# Altium project MC_CK.PrjPcb
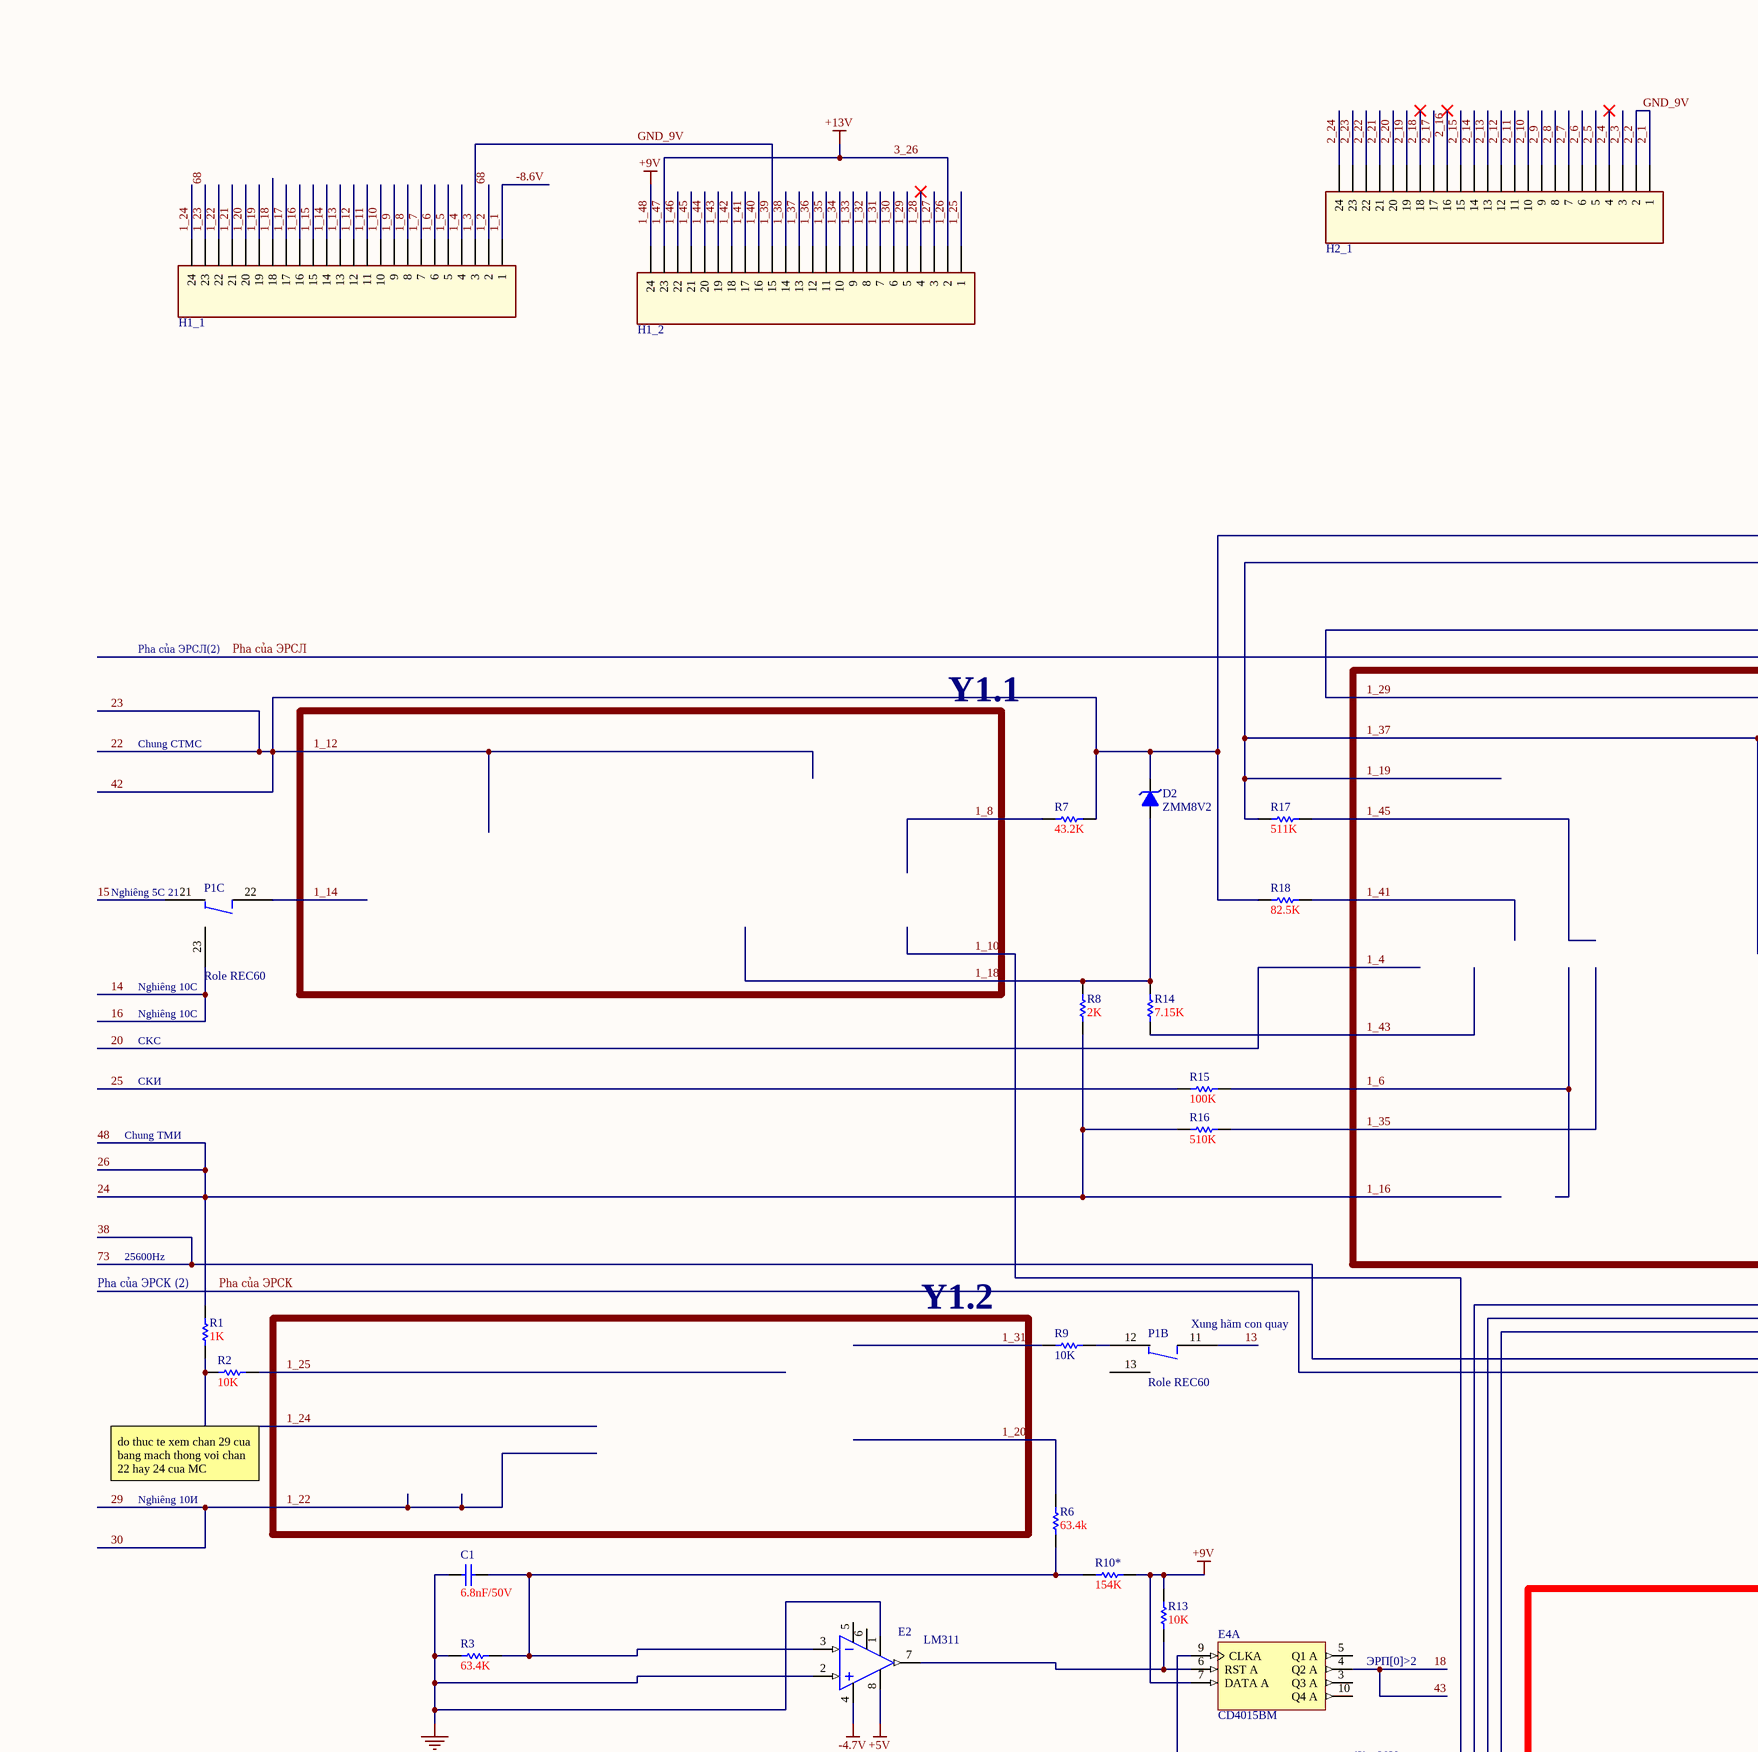
[diagram p0: MC1516.SchDoc, top left]
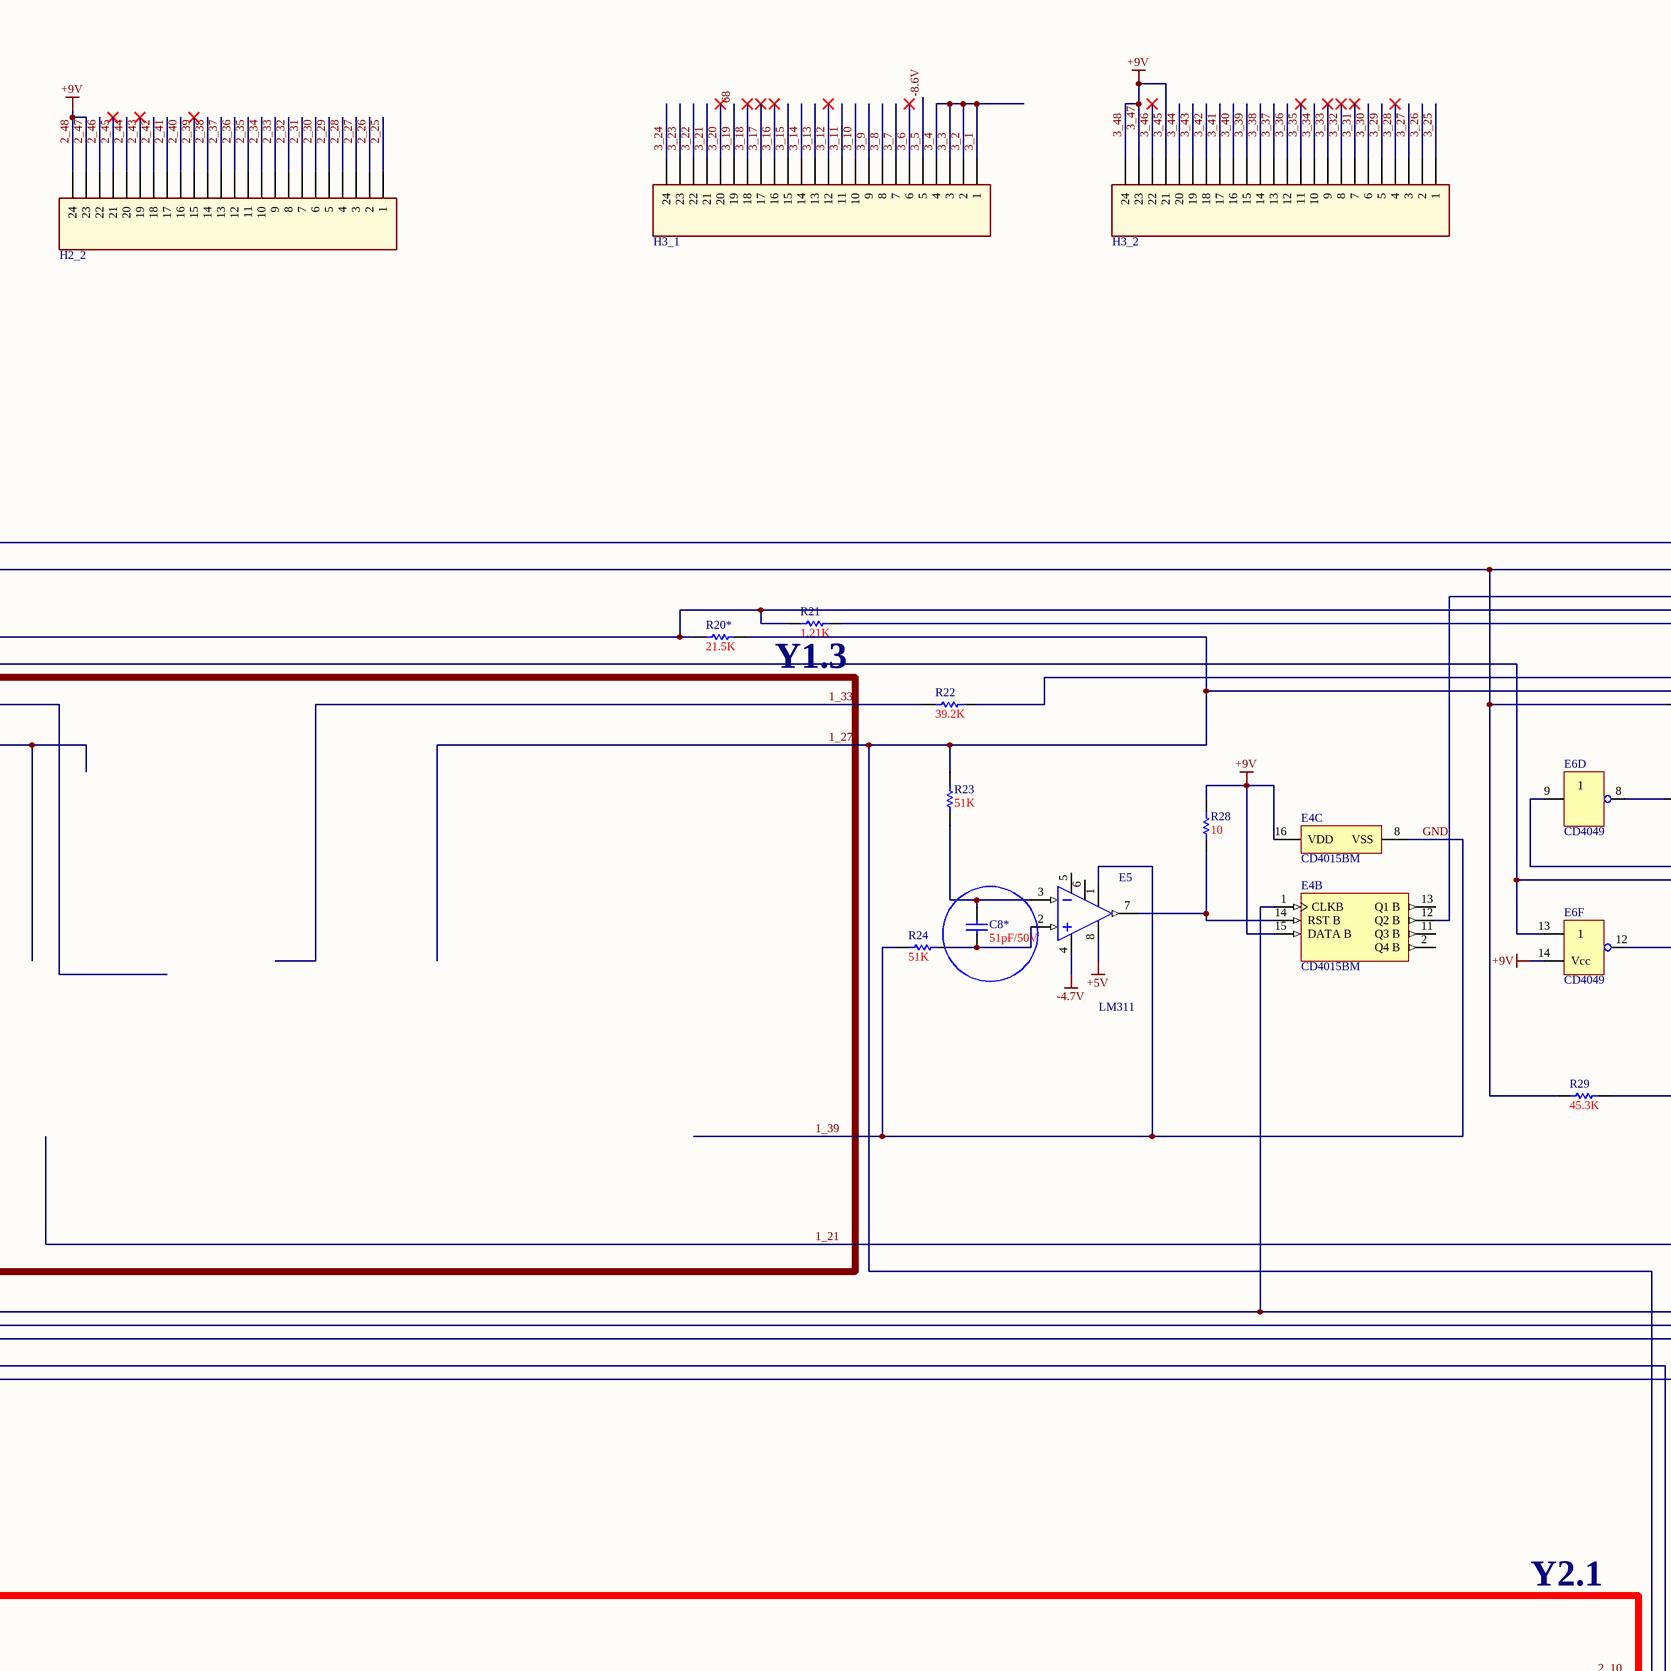
[diagram p1: MC1516.SchDoc, top middle]
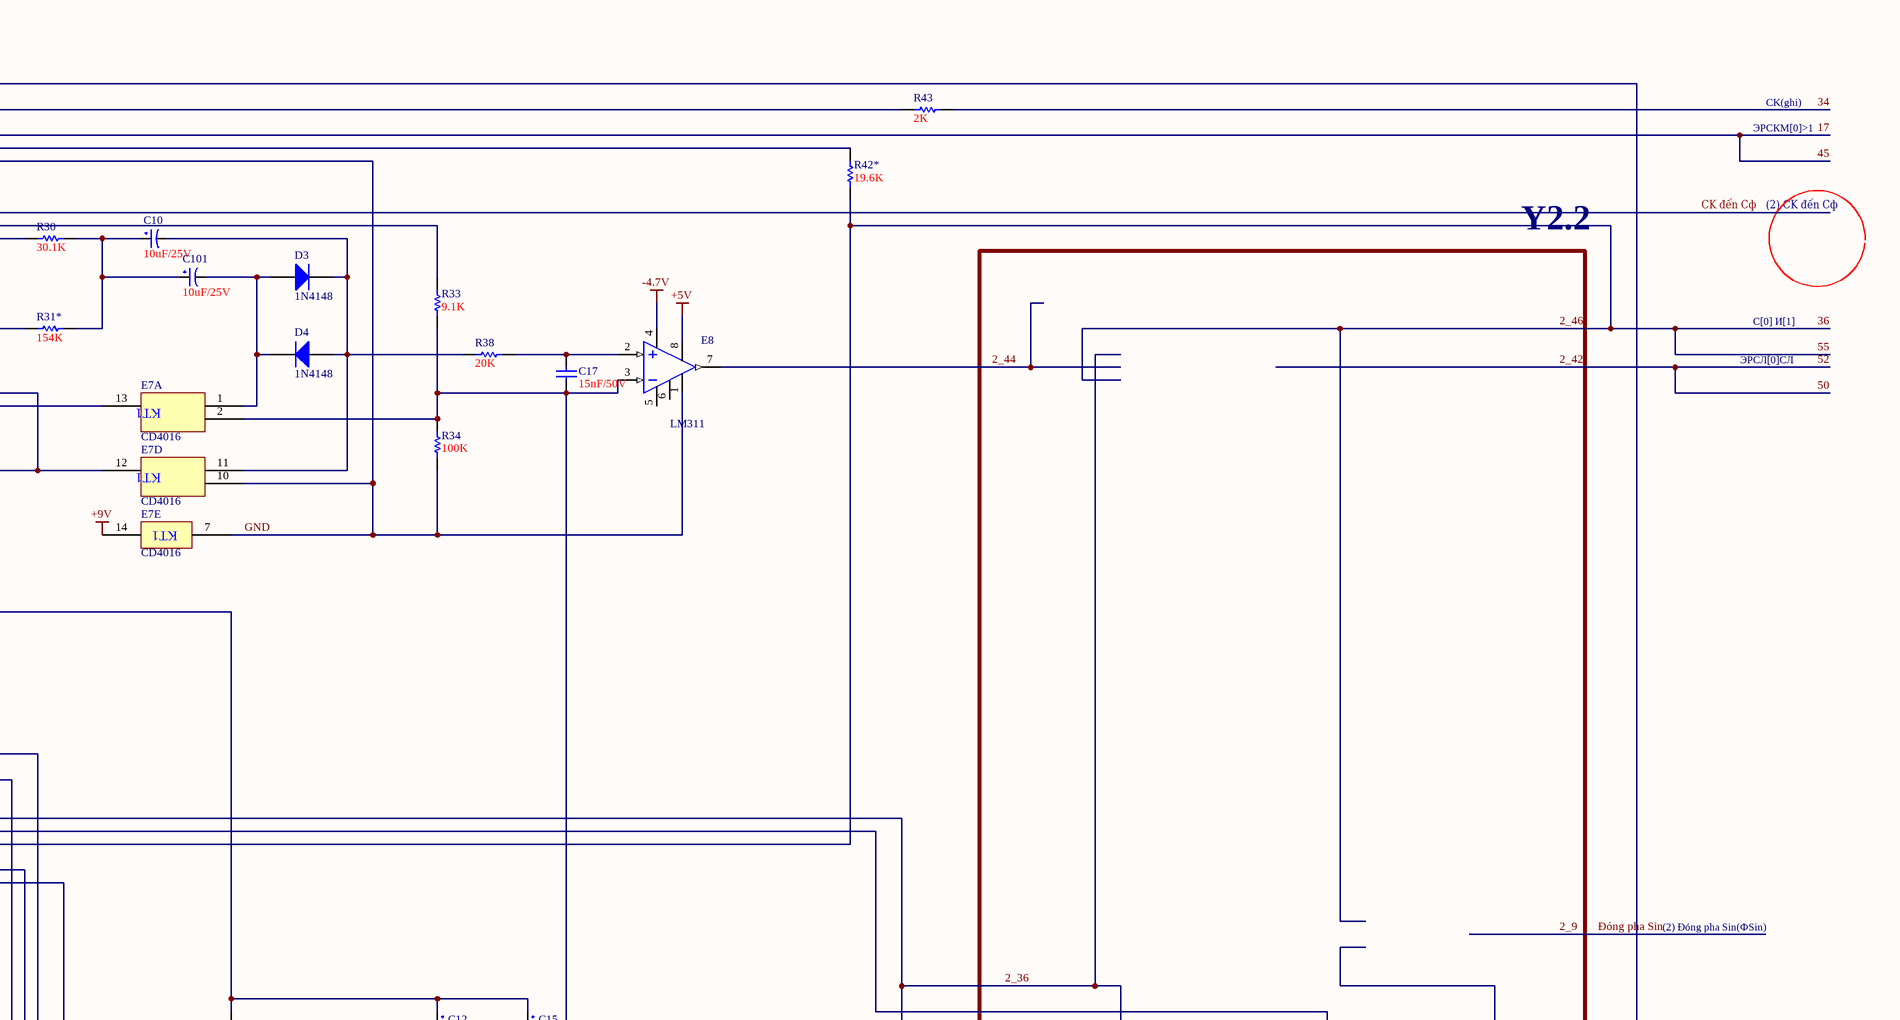
[diagram p2: MC1516.SchDoc, top right]
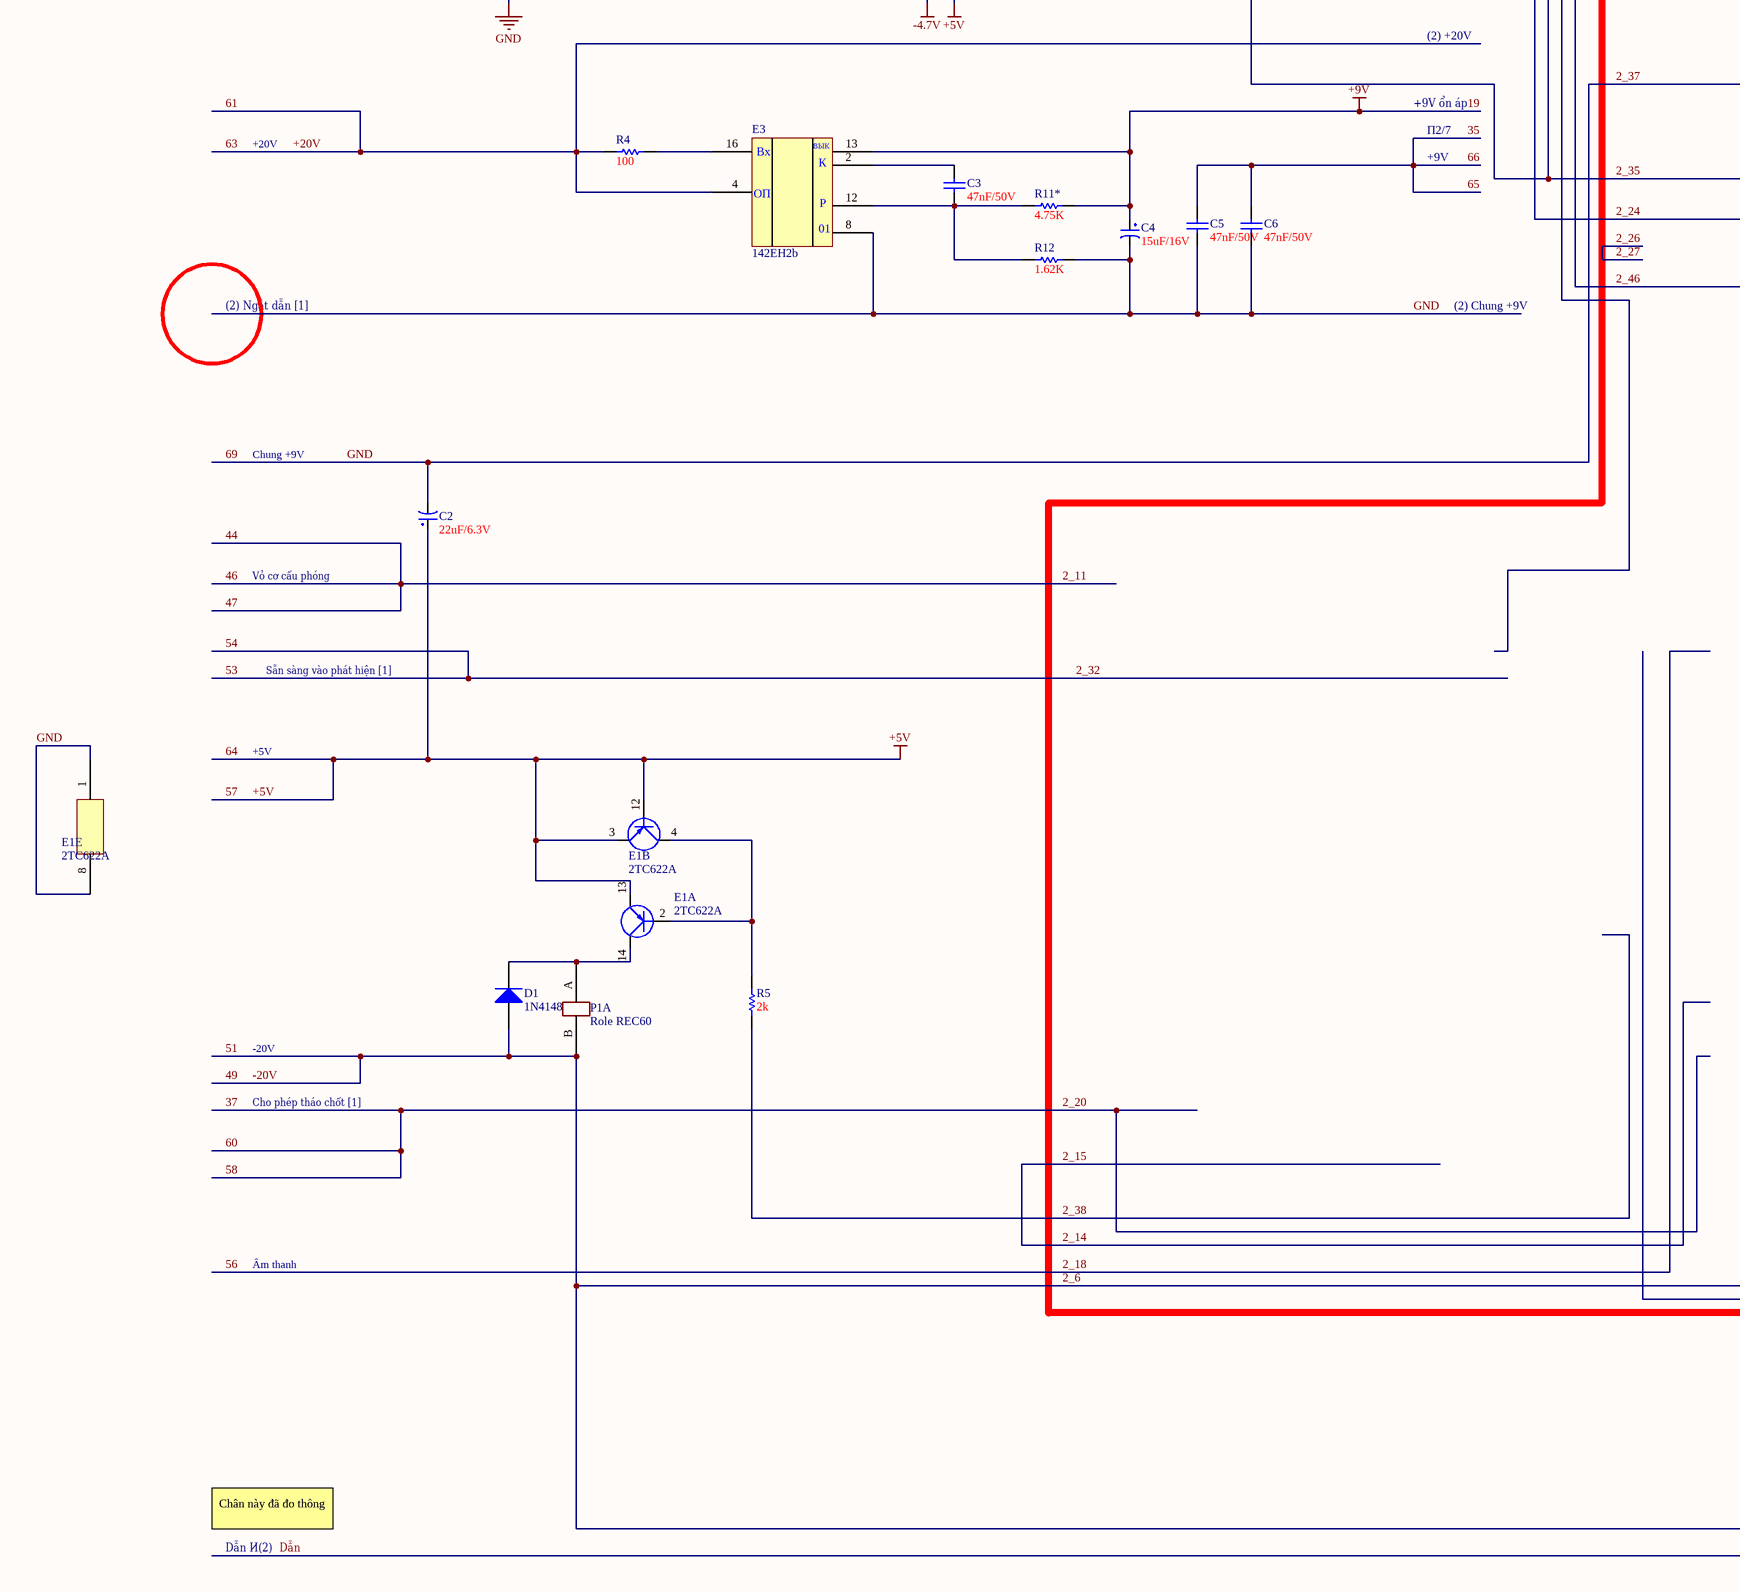
[diagram p3: MC1516.SchDoc, bottom left]
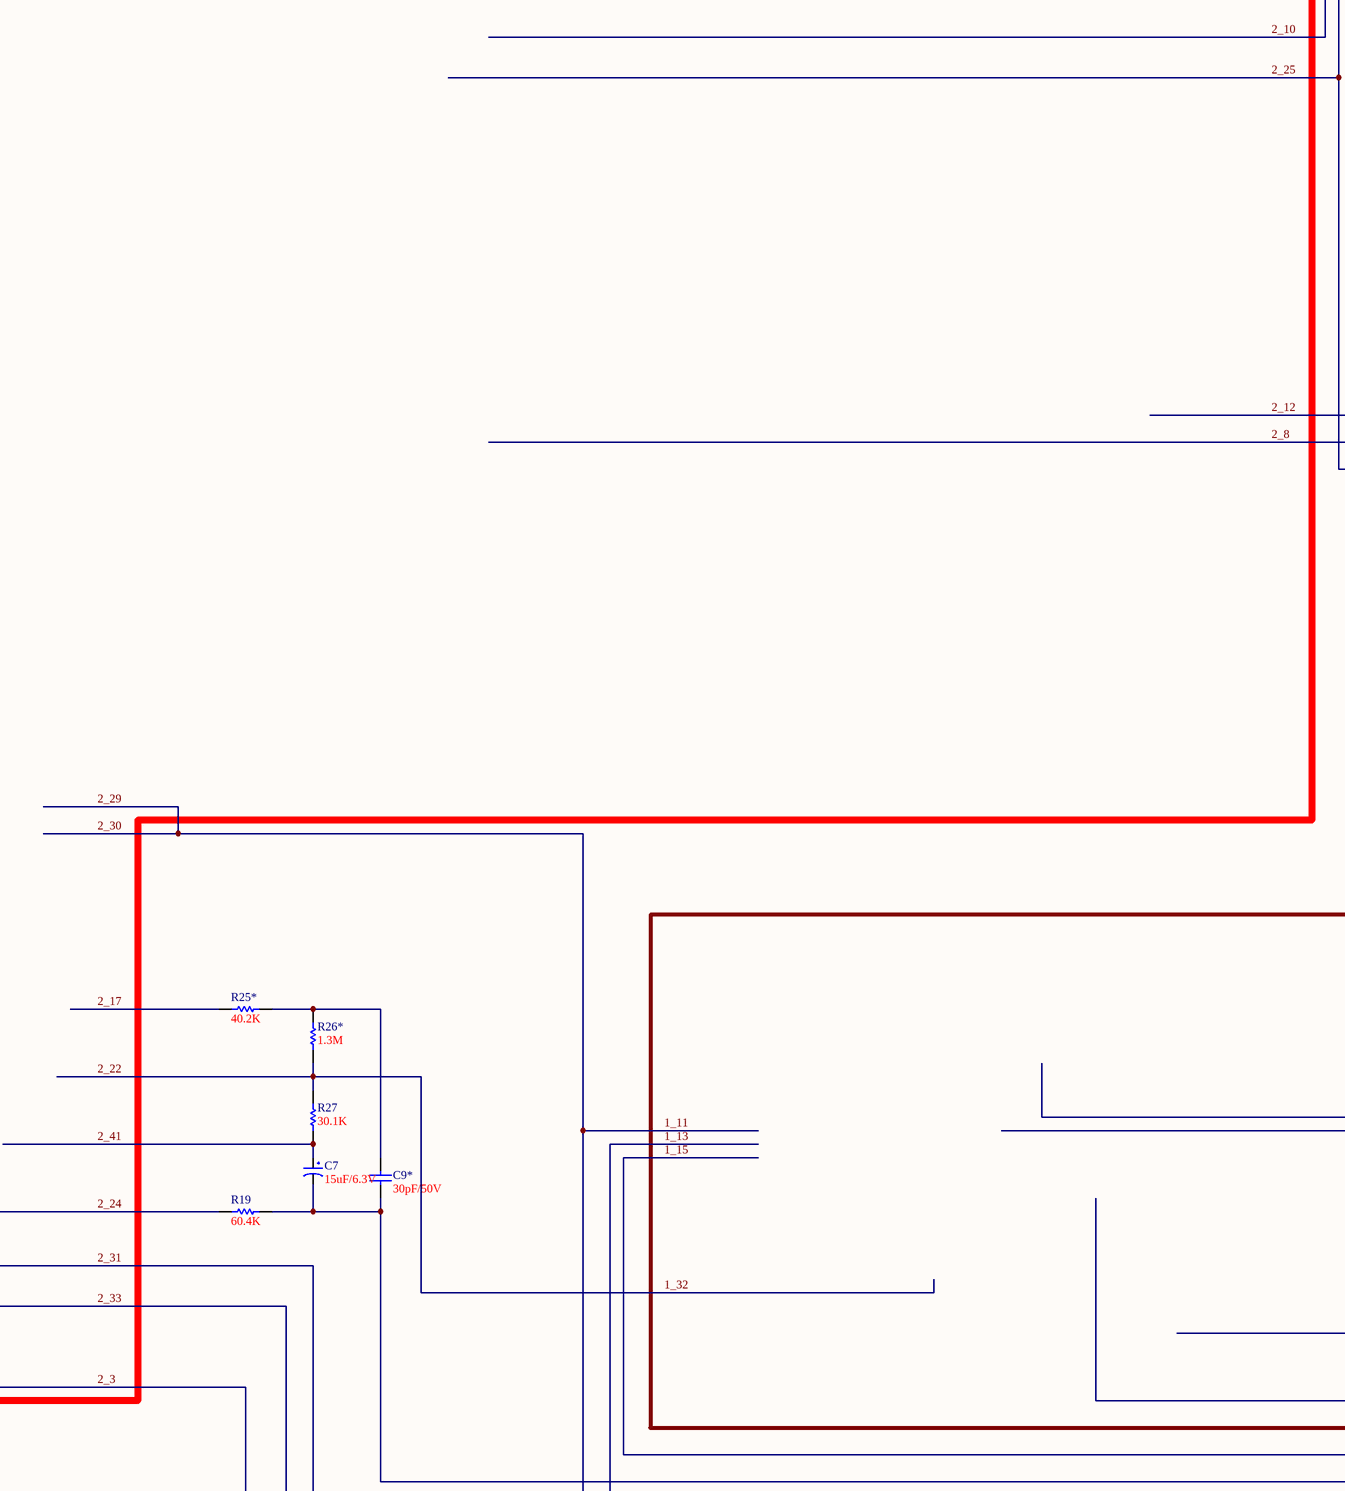
[diagram p4: MC1516.SchDoc, bottom middle]
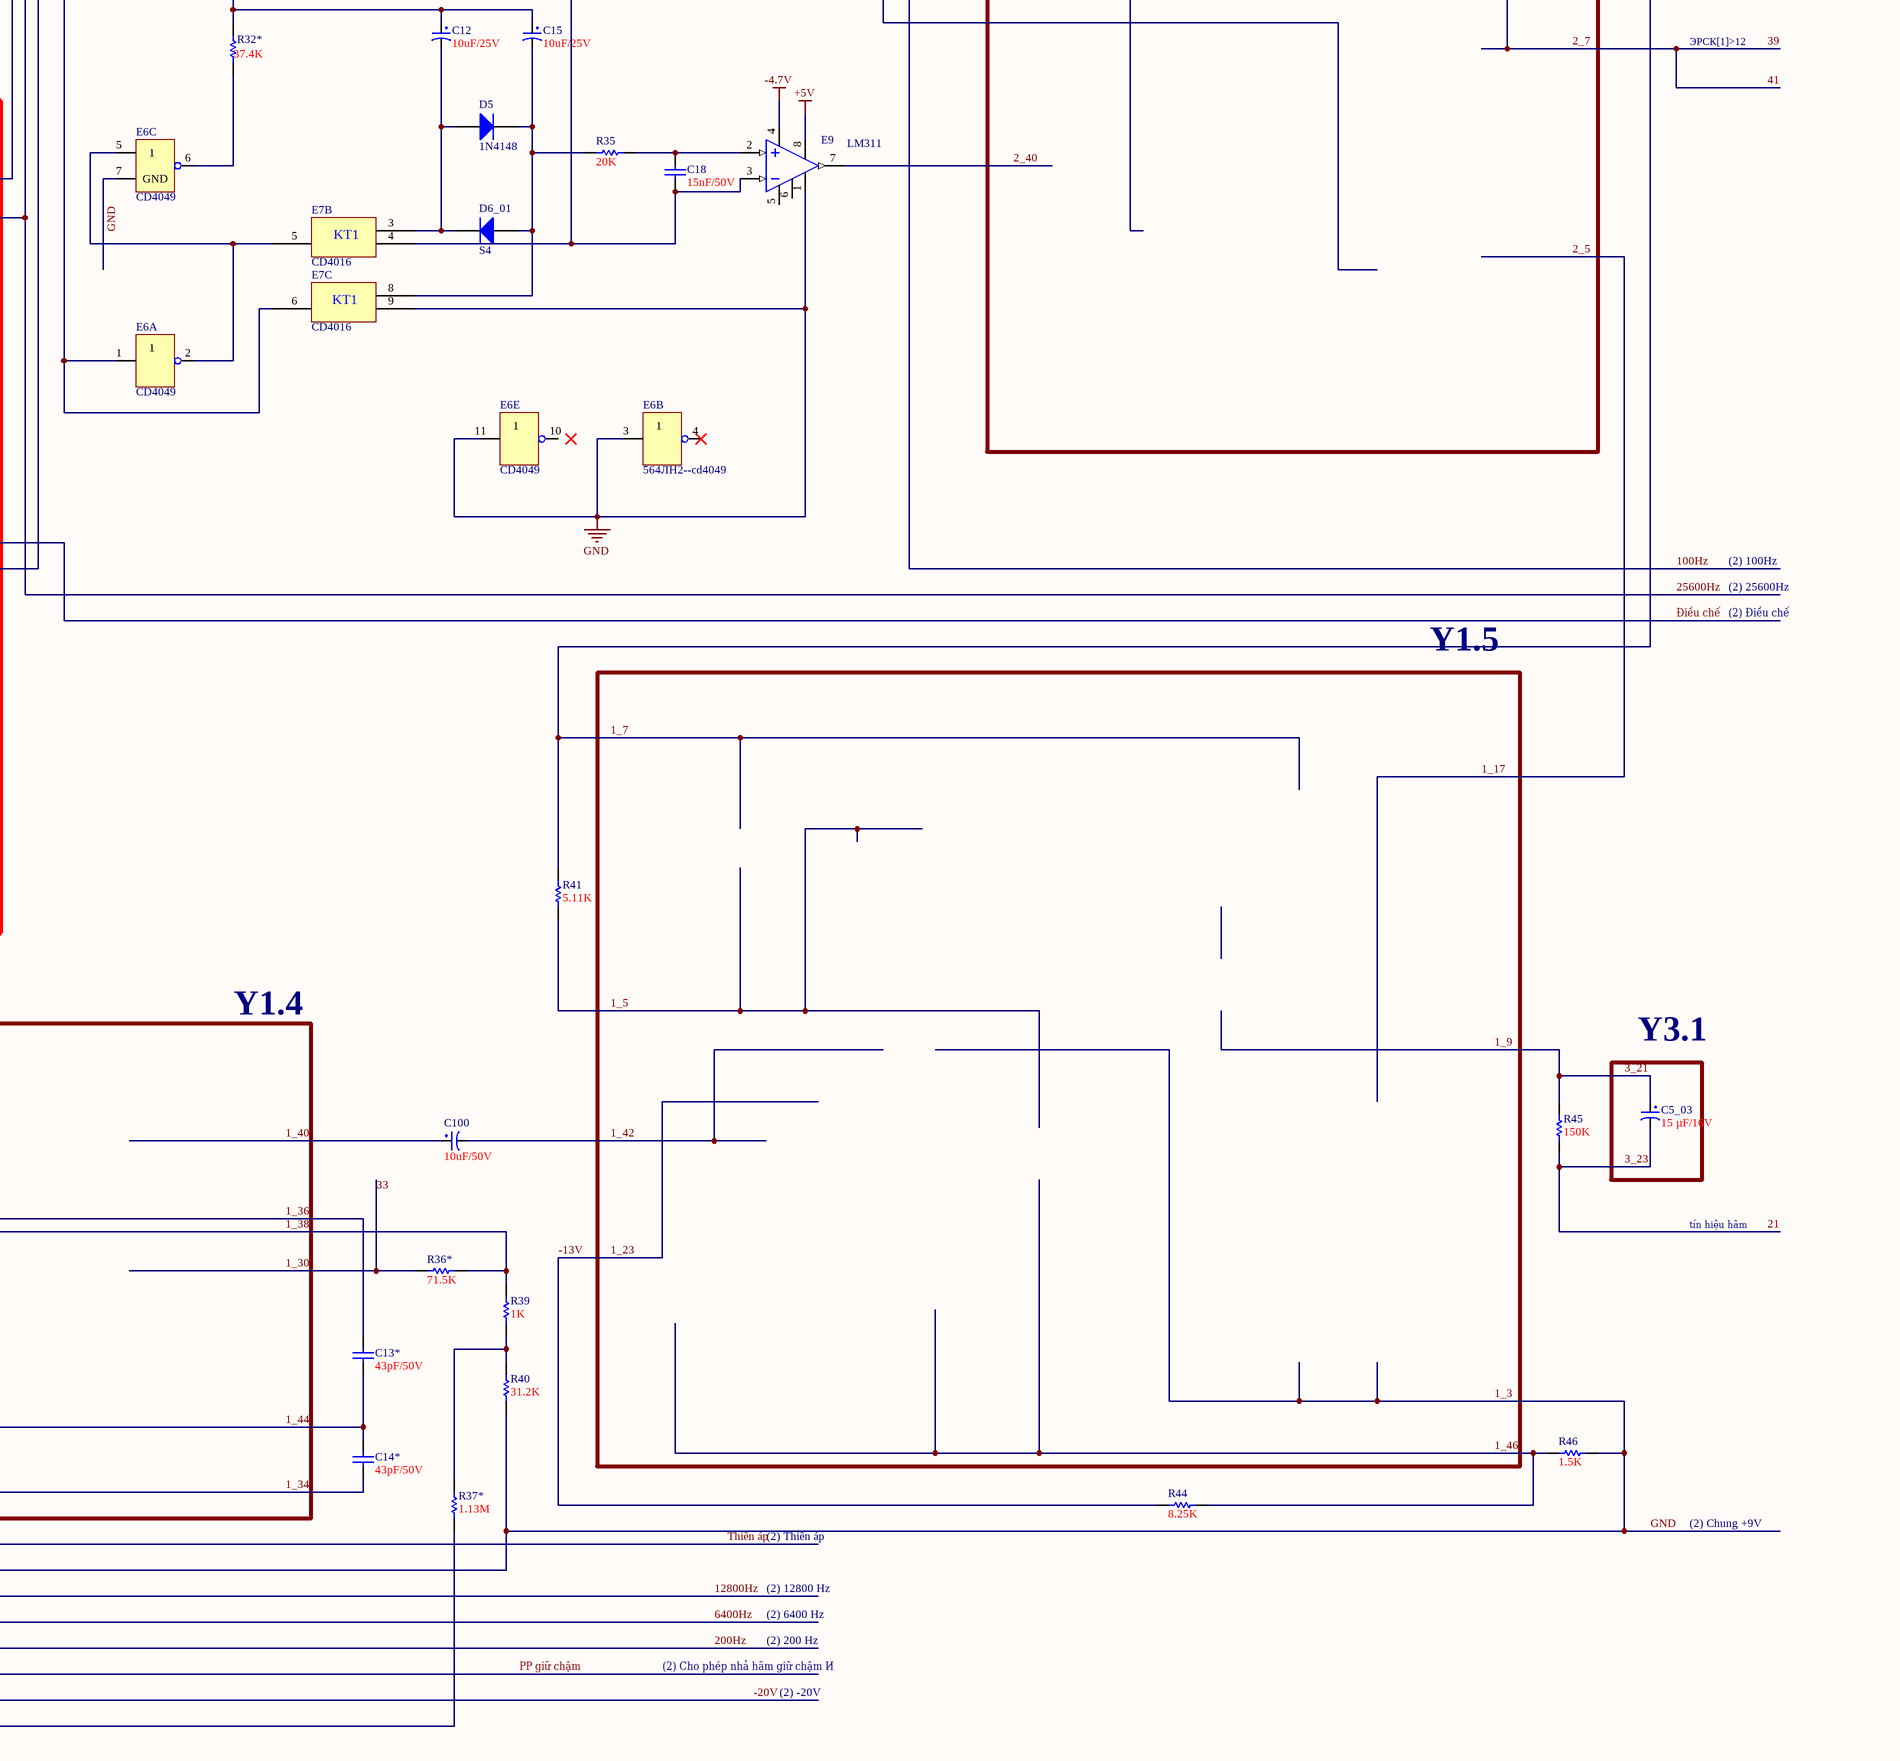
[diagram p5: MC1516.SchDoc, bottom right]
2 sheets, 124 parts. Net scope: global (net labels, ports and power ports of the same name join across sheets).
Board file: MC_CK.PcbDoc
Sheets:
  MC1516.SchDoc
  MC1617.SchDoc

## Sheet MC1516.SchDoc
size A0; SheetNumber: 1; SheetTotal: 2

### Parts
C1  6.8nF/50V  [C0805]
C2  22uF/6.3V  [3216]
C3  47nF/50V  [C0805]
C4  15uF/16V  [C3528]
C5  47nF/50V  [C0805]
C5_03  15 µF/16V  [3528]
C6  47nF/50V  [C0805]
C7  15uF/6.3V  [3216]
C8*  51pF/50V  [C0805]
C9*  30pF/50V  [C0805]
C10  10uF/25V  [3528]
C12  10uF/25V  [3528]
C13*  43pF/50V  [C0805]
C14*  43pF/50V  [C0805]
C15  10uF/25V  [3528]
C17  15nF/50V  [C0805]
C18  15nF/50V  [C0805]
C100  10uF/50V  [3528]
C101  10uF/25V  [3528]
D1  1N4148  [sod123]
D2  ZMM8V2  [sod-80]
D3  1N4148  [sod123]
D4  1N4148  [sod123]
D5  1N4148  [sod123]
D6_01  S4  [SOD123]
E1  2ТС622А  [1533LN1]  (parts A,B,E of 5)
E2  LM311  [soic8]
E3  142EH2b  [142EN2A]
E4  CD4015BM  [soic16n]  (parts A,B,C of 3)
E5  LM311  [soic8]
E6  CD4049  [soic14]  (parts A,B,C,D,E,F of 6)
E7  CD4016  [soic14]  (parts A,B,C,D,E of 5)
E8  LM311  [soic8]
E9  LM311  [soic8]
H1_1  Header 24  [header 24]  (value not drawn)
H1_2  Header 24  [header 24]  (value not drawn)
H2_1  Header 24  [header 24]  (value not drawn)
H2_2  Header 24  [header 24]  (value not drawn)
H3_1  Header 24  [header 24]  (value not drawn)
H3_2  Header 24  [header 24]  (value not drawn)
P1  Role REC60  [REK60]  (parts A,B,C of 3)
R1  1K  [R0805]
R2  10K  [R0805]
R3  63.4K  [R0805]
R4  100  [res1206]
R5  2k  [R0805]
R6  63.4k  [R0805]
R7  43.2K  [R0805]
R8  2K  [R0805]
R9  10K  [R0805]
R10*  154K  [R0805]
R11*  4.75K  [R0805]
R12  1.62K  [R0805]
R13  10K  [R0805]
R14  7.15K  [R0805]
R15  100K  [r0805]
R16  510K  [R0805]
R17  511K  [R0805]
R18  82.5K  [R0805]
R19  60.4K  [R0805]
R20*  21.5K  [R0805]
R21  1.21K  [R0805]
R22  39.2K  [R0805]
R23  51K  [R0805]
R24  51K  [R0805]
R25*  40.2K  [R0805]
R26*  1.3M  [R0805]
R27  30.1K  [R0805]
R28  10  [R0805]
R29  45.3K  [R0805]
R30  30.1K  [R0805]
R31*  154K  [R0805]
R32*  37.4K  [R0805]
R33  9.1K  [R0805]
R34  100K  [R0805]
R35  20K  [R0805]
R36*  71.5K  [R0805]
R37*  1.13M  [R0805]
R38  20K  [R0805]
R39  1K  [R0805]
R40  31.2K  [R0805]
R41  5.11K  [R0805]
R42*  19.6K  [R0805]
R43  2K  [R0805]
R44  8.25K  [R0805]
R45  150K  [R0805]
R46  1.5K  [R0805]

### Blocks framed on the sheet
Y3.1: C5_03

### Nets
1_3: C1.2 C2.2 C4.2 C5.2 C6.2 C7.2 C9*.2 E1.1 E1.8 E2.1(COM) E2.2(IN+) E3.8 E4.8(VSS) E5.1(COM) E6.3 E6.7(GND) E6.11 E7.7 E7.9 E7.10 E8.1(COM) E9.1(COM) H1_1.3 H1_2.15 H2_1.1 H2_1.2 H2_2.13 H3_1.1 H3_1.2 H3_1.3 H3_1.4 R3.2 R12.1 R19.2 R21.2 R24.2 R34.2 R40.2 R46.2  [also labelled 1_39, 2_1, 2_2, 2_37, 3_1, 3_2, 3_3, 3_4, 69, GND, GND_9V]
1_26: H1_2.2 H1_2.23 H3_2.2  [also labelled +13V, 1_47, 3_26]
19: C4.1 C5.1 C6.1 E3.13 E4.7(DATA_A) E4.15(DATA_B) E4.16(VDD) E6.14(Vcc) E7.14 H1_1.4 H1_2.24 H2_2.23 H2_2.24 H3_2.21 H3_2.23 H3_2.24 R10*.1 R11*.1 R13.1 R28.2  [also labelled +9V, 1_4, 1_48, 20, 2_47, 2_48, 35, 3_45, 3_47, 3_48, 65, 66]
+5V: C2.1 E1.3 E1.12 E1.13 E2.8(+V) E5.8(+V) E8.8(+V) E9.8(+V)  [also labelled 57, 64]
-4.7V: E2.4(-V) E5.4(-V) E8.4(-V) E9.4(-V) H1_1.15 H2_1.19 H3_2.20  [also labelled 1_15, 2_19, 3_44, Thiên áp]
1_5: H1_1.5 R41.2
1_6: H1_1.6 R15.1
1_8: H1_1.8 R7.1
1_9: C5_03.1 H1_1.9 H3_1.21 R45.2  [also labelled 3_21]
1_10: H1_1.10 H2_1.24 R19.1  [also labelled 2_24]
1_12: D2.2(K) H1_1.7 H1_1.12 R7.2 R18.2 R41.1  [also labelled 1_7, 22, 23, 42]
1_13: H1_1.13 H2_2.7 H3_2.16  [also labelled 2_31, 3_40, 6400Hz]
1_14: H1_1.14 P1.22
1_16: H1_1.16 R1.1 R8.1 R16.2  [also labelled 24, 26, 48]
1_17: H1_1.17 H2_1.5  [also labelled 2_5]
1_18: D2.1(A) H1_1.18 R8.2 R14.2
1_19: H1_1.19 H1_2.13 R17.2 R29.1 R30.2 R43.1  [also labelled 1_37]
1_20: H1_1.20 R6.2
1_21: H1_1.21 H2_1.8  [also labelled 2_8]
1_22: H1_1.22  [also labelled 29, 30]
1_24: H1_1.24 R1.2 R2.1
1_25: H1_2.1 R2.2
1_27: H1_2.3 H2_1.10 R20*.2 R23.2 R33.1  [also labelled 2_10]
1_28: H1_2.4
1_29: H1_2.5 R20*.1 R21.1 R42*.1
1_30: H1_2.6 R36*.2  [also labelled 33]
1_31: H1_2.7 R9.2
1_32: H1_2.8 H2_1.22 R26*.1 R27.2  [also labelled 2_22]
1_33: H1_2.9 R22.1
1_34: C14*.2 H1_2.10
1_35: H1_2.11 R16.1
1_36: C13*.1 H1_2.12
1_38: H1_2.14 R36*.1 R39.1
1_40: C100.1 H1_2.16
1_41: H1_2.17 R18.1
1_42: C100.2 H1_2.18
1_43: H1_2.19 R14.1
1_44: C13*.2 C14*.1 H1_2.20
1_45: H1_2.21 R17.1
1_46: H1_2.22 R44.2 R46.1
2_3: H2_1.3 H3_1.14  [also labelled 3_14, PP giữ chậm]
2_4: H2_1.4
2_7: H2_1.7  [also labelled 39, 41]
2_9: H2_1.9 H3_2.19  [also labelled 3_43, Đóng pha Sin]
2_11: H2_1.11  [also labelled 44, 46, 47]
2_12: H2_1.12 H2_1.13  [also labelled 2_13, Điều chế]
2_14: H2_1.14 H2_1.15  [also labelled 2_15]
2_16: H2_1.16
2_17: H2_1.17 R25*.1
2_18: H2_1.18  [also labelled 56]
2_20: H2_1.20  [also labelled 37, 58, 60]
2_21: H2_1.21
2_23: H2_1.23 R22.2  [also labelled CK đến Cф]
2_26: H2_2.2 H2_2.3  [also labelled 2_27]
2_32: H2_2.8  [also labelled 53, 54]
2_38: H2_2.14 R5.2
2_39: H2_2.15
2_40: E9.7(OUT) H2_2.16
2_41: C7.1 H2_2.17 R27.1
2_42: H2_2.18  [also labelled 50, 52]
2_43: H2_2.19
2_44: E8.7(OUT) H2_2.20
2_45: H2_2.21
2_46: H2_2.22 R42*.2  [also labelled 36, 55]
3_6: H3_1.6
3_7: H3_1.7
3_8: H3_1.8
3_9: H3_1.9
3_11: H3_1.11
3_12: H3_1.12
3_13: H3_1.13
3_15: H3_1.15
3_16: H3_1.16
3_17: H3_1.17
3_18: H3_1.18
3_20: H3_1.20
3_22: H3_1.22
3_24: H3_1.24
3_25: H3_2.1
3_27: E6.1 E7.6 H3_2.3  [also labelled Pha của ЭРСК]
3_28: H3_2.4
3_30: H3_2.6
3_31: H3_2.7
3_32: H3_2.8
3_33: H3_2.9
3_34: H3_2.10
3_35: H3_2.11
3_36: H3_2.12
3_37: H3_2.13
3_39: E6.13 E7.13 H3_2.15  [also labelled Pha của ЭРСЛ]
3_41: H3_2.17
3_42: H3_2.18 R37*.2  [also labelled Dẫn]
3_46: H3_2.22
13: P1.11
14: P1.23  [also labelled 16]
15: P1.21
17: E4.12(Q2_B)  [also labelled 45]
18: E4.4(Q2_A)  [also labelled 43]
21: C5_03.2 H3_1.23 R45.1  [also labelled 3_23]
25: R15.2
34: R43.2
100Hz: E4.1(CLKB) E4.9(CLKA) H2_2.11 H2_2.12 H3_2.5  [also labelled 2_35, 2_36, 3_29]
200Hz: H2_2.9 H2_2.10  [also labelled 2_33, 2_34]
12800Hz: H1_1.11 H2_2.5 H2_2.6 H3_2.14  [also labelled 1_11, 2_29, 2_30, 3_38]
25600Hz: H2_2.1 H3_1.10  [also labelled 2_25, 38, 3_10, 73]
+20V: E3.4 H2_2.4 R4.2  [also labelled 2_28, 61, 63]
-8.6V: H1_1.1 H3_1.5  [also labelled 1_1, 3_5]
-13V: H1_1.2 H1_1.23 H3_1.19 R44.1  [also labelled 1_2, 1_23, 3_19, 68]
-20V: D1.1(A) H2_1.6 P1.B  [also labelled 2_6, 49, 51]
NetC1_1: C1.1 E2.3(IN-) R3.1 R6.1 R10*.2
NetC3_1: C3.1 E3.2
NetC3_2: C3.2 E3.12 R11*.2 R12.2
NetC8*_1: C8*.1 E5.3(IN-) R23.1
NetC8*_2: C8*.2 E5.2(IN+) R24.1
NetC9*_1: C9*.1 R25*.2 R26*.2
NetC10_1: C10.1 C101.1 R30.1 R31*.1
NetC10_2: C10.2 D3.2(K) D4.1(A) E7.11 R38.1
NetC12_1: C12.1 C15.1 R29.2 R32*.1
NetC12_2: C12.2 D5.1(A) D6_01.2(K) E7.3
NetC15_2: C15.2 D5.2(K) D6_01.1(A) E7.8 R35.1
NetC17_1: C17.1 C18.1 E7.2 E7.4 E8.3(IN-) E9.3(IN-) R33.2 R34.1
NetC17_2: C17.2 E8.2(IN+) R38.2
NetC18_2: C18.2 E9.2(IN+) R35.2
NetC101_2: C101.2 D3.1(A) D4.2(K) E7.1
NetD1_2: D1.2(K) E1.14 P1.A
NetE1_2: E1.2 E1.4 R5.1
NetE2_7: E2.7(OUT) E4.6(RST_A) R13.2
NetE3_16: E3.16 R4.1
NetE4_14: E4.14(RST_B) E5.7(OUT) R28.1
NetE6_2: E6.2 E6.5 E7.5
NetE6_6: E6.6 R32*.2
NetE6_8: E6.8 R31*.2
NetE6_9: E6.9 E6.12 E7.12
NetP1_12: P1.12 R9.1
NetR37*_1: R37*.1 R39.2 R40.1

Not connected (* = marked no-connect by the designer): E2 5 6; E4 2(Q4_B) 3(Q3_A) 5(Q1_A) 10(Q4_A) 11(Q3_B) 13(Q1_B); E5 5 6; E6 4* 10; E8 5 6; E9 5 6; P1 13

### Notes on the sheet
- ЭРСКМ[0]>1
- CK(ghi)
- Pha của ЭРСЛ(2)
- (near R21) Y1.3
- (2) CK đến Cф
- Chung CТМC
- Y1.1
- Y2.2
- C[0] И[1]
- ЭРСЛ[0]СЛ
- (near P1) Nghiêng 5C 21
- Nghiêng 10C
- CKC
- CKИ
- Chung ТМИ
- (near R1) Pha của ЭРСК (2)
- 25600Hz
- Y1.2
- (near P1) Xung hãm con quay
- (2) Đóng pha Sin(ФSin)
- do thuc te xem chan 29 cua bang mach thong voi chan 22 hay 24 cua MC
- Nghiêng 10И
- ЭРСК[1]>12
- Y2.1
- (near E4) ЭРП[0]>2
- (2) +20V
- +9V ổn áp
- +20V
- П2/7
- +9V
- (2) Ngắt dẫn [1]
- (2) Chung +9V
- (2) 25600Hz
- (2) 100Hz
- Y1.5
- (2) Điều chế
- Chung +9V
- Vỏ cơ cấu phóng
- Sẵn sàng vào phát hiện [1]
- +5V
- Y1.4
- -20V
- tín hiệu hãm
- Cho phép tháo chốt [1]
- Âm thanh
- (2) Thiên áp
- (2) 12800 Hz
- (2) 6400 Hz
- Chân này đã đo thông
- (2) Cho phép nhả hãm giữ chậm И
- (2) 200 Hz
- (2) -20V
- Dẫn И(2)
- (in symbol 142EH) ВЫК; Вх; К; ОП; Р; 01
- (in symbol CD4016, part A) KT1
- (in symbol CD4016, part B) KT1
- (in symbol CD4016, part C) KT1
- (in symbol CD4016, part D) KT1
- (in symbol CD4016, part E) KT1

### Library data of the parts
C1 C3 C5 C6 C8* C9* C13* C14* C17 C18 = Cap ceramic: None polar capacitor; ASiD Part Number: C-AS
  C1: Value: 6.8nF/50V
  C3 C5 C6: Value: 47nF/50V
  C8*: Value: 51pF/50V
  C9*: Value: 30pF/50V
  C13* C14*: Value: 43pF/50V
  C17 C18: Value: 15nF/50V
C2 C4 = CP1: Cap P  0,1uF < 22uF , 16 - 50V; Value: 10uF/50V; Description 1: 10 => 220uF/6,3V/10V - 10uF => 100uF/16V; Description 2: 0,1uF => 33uF/50V - 10uF => 22uF/63V; Description 3: 0,47uF => 10uF/100V
C5_03 C7 C10 C12 C15 C101 = CP2: C 47uF/50V , 220uF/16V; Value: 47uF/16 - 50V; Description 1: 470uF/6,3V - 330uF/10V - 220uF/16V; Description 2: 100uF/25V - 35V - 47uF/50V - 22uF/100V; Description 3: 33uF => 47uF/63V - 1uF => 4,7uF/160V; Description 4: 1uF => 2,2uF/250V - 1uF/350V
C100 = CP2: C15->C100; Value: 47uF/16 - 50V; Description 1: 470uF/6,3V - 330uF/10V - 220uF/16V; Description 2: 100uF/25V - 35V - 47uF/50V - 22uF/100V; Description 3: 33uF => 47uF/63V - 1uF => 4,7uF/160V; Description 4: 1uF => 2,2uF/250V - 1uF/350V
D1 D3-D5 D6_01 = Diode S4: Dán; Ten_Linh_Kien: Diode S4 SOD123 ( 1N5819 SOD123); Ma_Hang: MH005519; Don_Vi: Con; Ghi_Chu: *; Chung_Loai: Dán; Kieu_Chan: *
D2 = Zener
E1 = 2ТС622А: PNP
E2 E5 E8 E9 = 521СА3: OpAmp
E3 = 142EH
E4 = CD4015BM: CMOS Dual 4-Stage Static Shift Register, D0016A, TUBE; Manufacturer: Texas Instruments; Technology Family: CD4000; VCC(Min)(V): 3; VCC(Max)(V): 18; Voltage(Nom)(V): 10; F @ Nom Voltage(Max)(Mhz): 8; ICC @ Nom Voltage(Max)(mA): 0.3; tpd @ Nom Voltage(Max)(ns): 160; Output Drive (IOL/IOH)(Max)(mA): 1.5/-1.5; 3-State Output: No; Rating: Catalog; Bits: 4; DatasheetVersion: SCHS025D; PackageReference: D0016A; Generic Part Number: CD4015B; Input Type: CMOS; Output Type: CMOS; Operating Temperature Range(C): -55 to 125; Code_JEDEC: MS-012 variation AC; PartNumber: CD4015BM; ComponentLink1Description: Manufacturer URL; ComponentLink1URL: http://www.ti.com/; ComponentLink2Description: Datasheet; ComponentLink2URL: http://www.ti.com/lit/ds/symlink/cd4015b.pdf; ComponentLink3Description: Package Specification; ComponentLink3URL: http://www.ti.com/lit/ml/mpds178g/mpds178g.pdf
E6 = 564ЛН2: NOT
E7 = CD4016: THAY CD4066 TỐT HƠN
R1-R9 R10* R11* R12-R19 R20* R21-R24 R25* R26* R27-R30 R31* R32* R33-R35 R36* R37* R38-R41 R42* R43-R46 = Res: Standard resistor; ASiD Part Number: Res-AS
  R1 R39: Value: 1K
  R2 R9 R13: Value: 10K
  R3: Value: 63.4K
  R4: Value: 100
  R5: Value: 2k
  R6: Value: 63.4k
  R7: Value: 43.2K
  R8 R43: Value: 2K
  R10* R31*: Value: 154K
  R11*: Value: 4.75K
  R12: Value: 1.62K
  R14: Value: 7.15K
  R15 R34: Value: 100K
  R16: Value: 510K
  R17: Value: 511K
  R18: Value: 82.5K
  R19: Value: 60.4K
  R20*: Value: 21.5K
  R21: Value: 1.21K
  R22: Value: 39.2K
  R23 R24: Value: 51K
  R25*: Value: 40.2K
  R26*: Value: 1.3M
  R27 R30: Value: 30.1K
  R28: Value: 10
  R29: Value: 45.3K
  R32*: Value: 37.4K
  R33: Value: 9.1K
  R35 R38: Value: 20K
  R36*: Value: 71.5K
  R37*: Value: 1.13M
  R40: Value: 31.2K
  R41: Value: 5.11K
  R42*: Value: 19.6K
  R44: Value: 8.25K
  R45: Value: 150K
  R46: Value: 1.5K

## Sheet MC1617.SchDoc
size 999 x 599 mm; SheetNumber: 2; SheetTotal: 2; SPICEModelCacheVUJZUAXU: <root> / <DocumentId>VUJZUAXU</DocumentId> / </root>
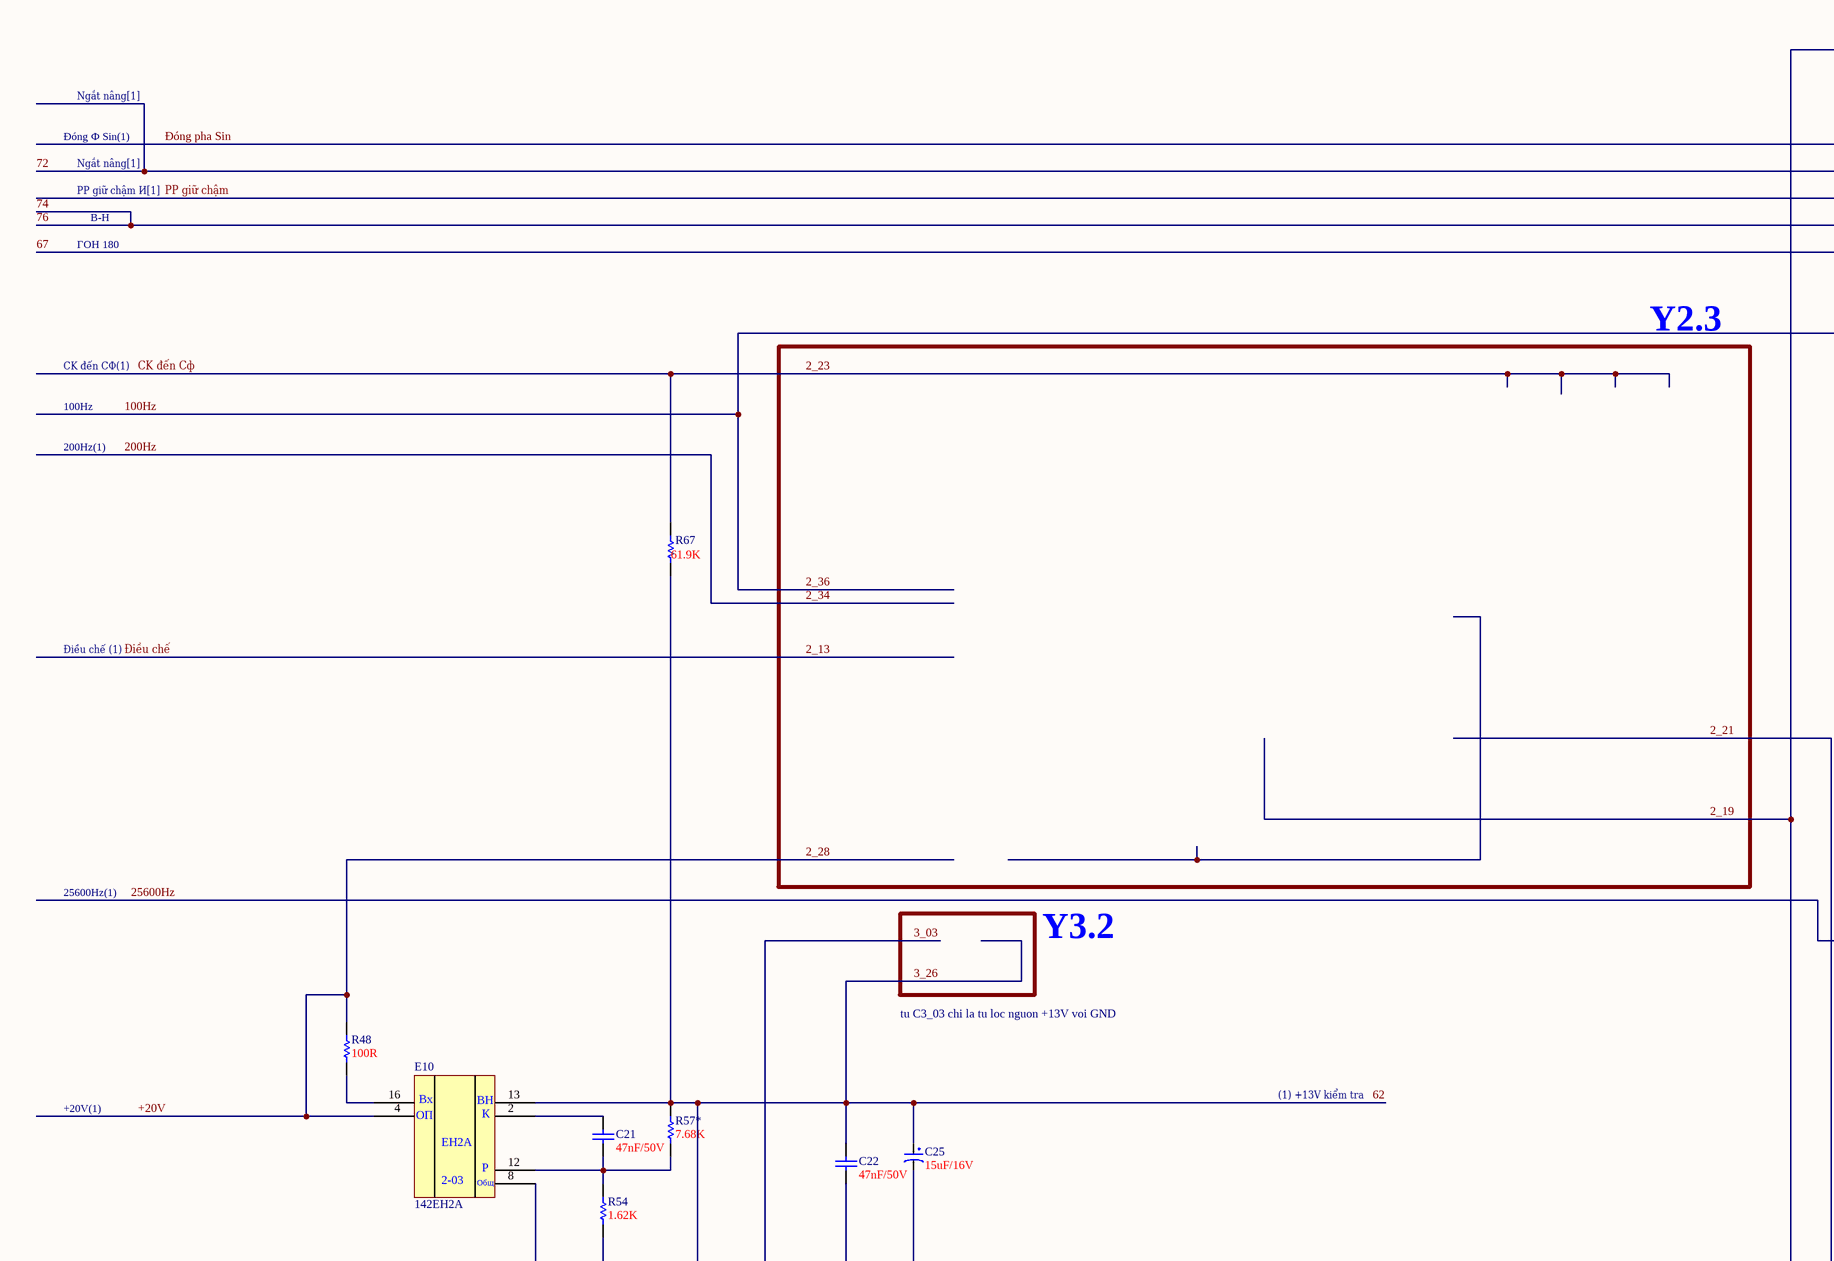
[diagram p6: MC1617.SchDoc, top left]
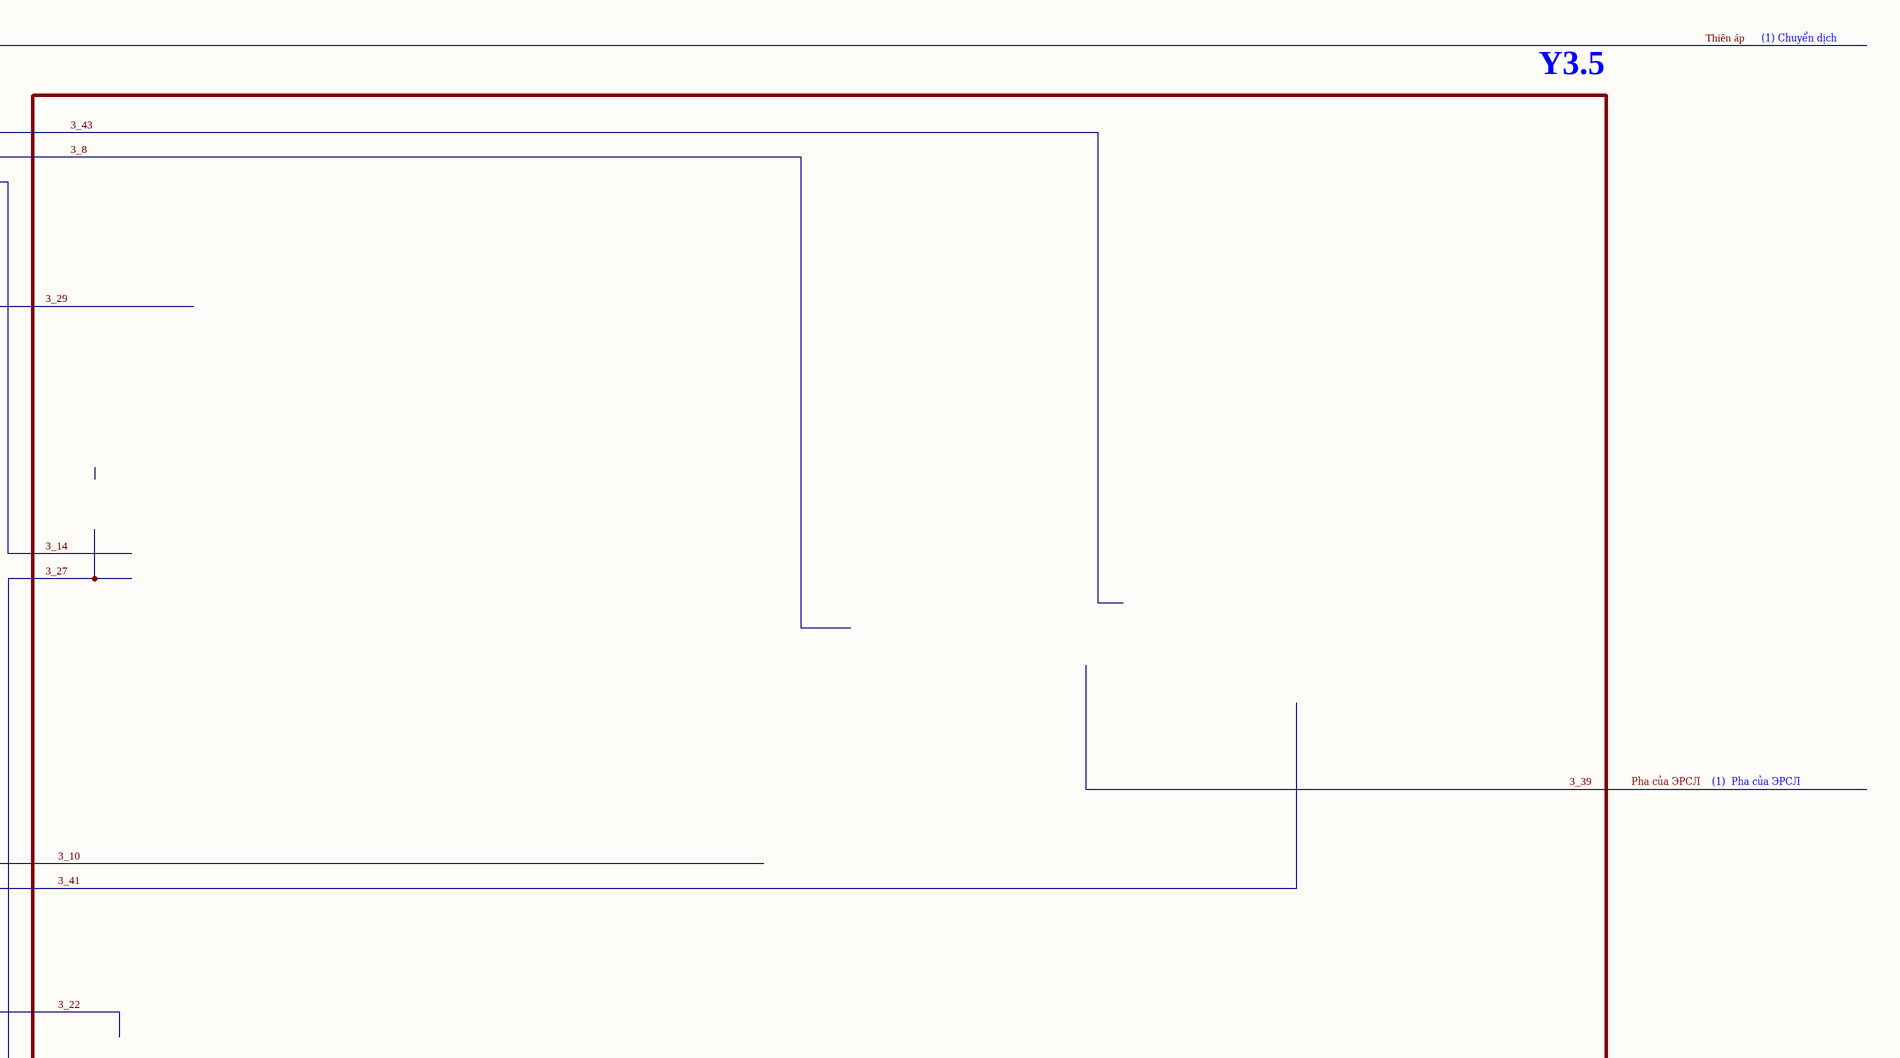
[diagram p7: MC1617.SchDoc, top right]
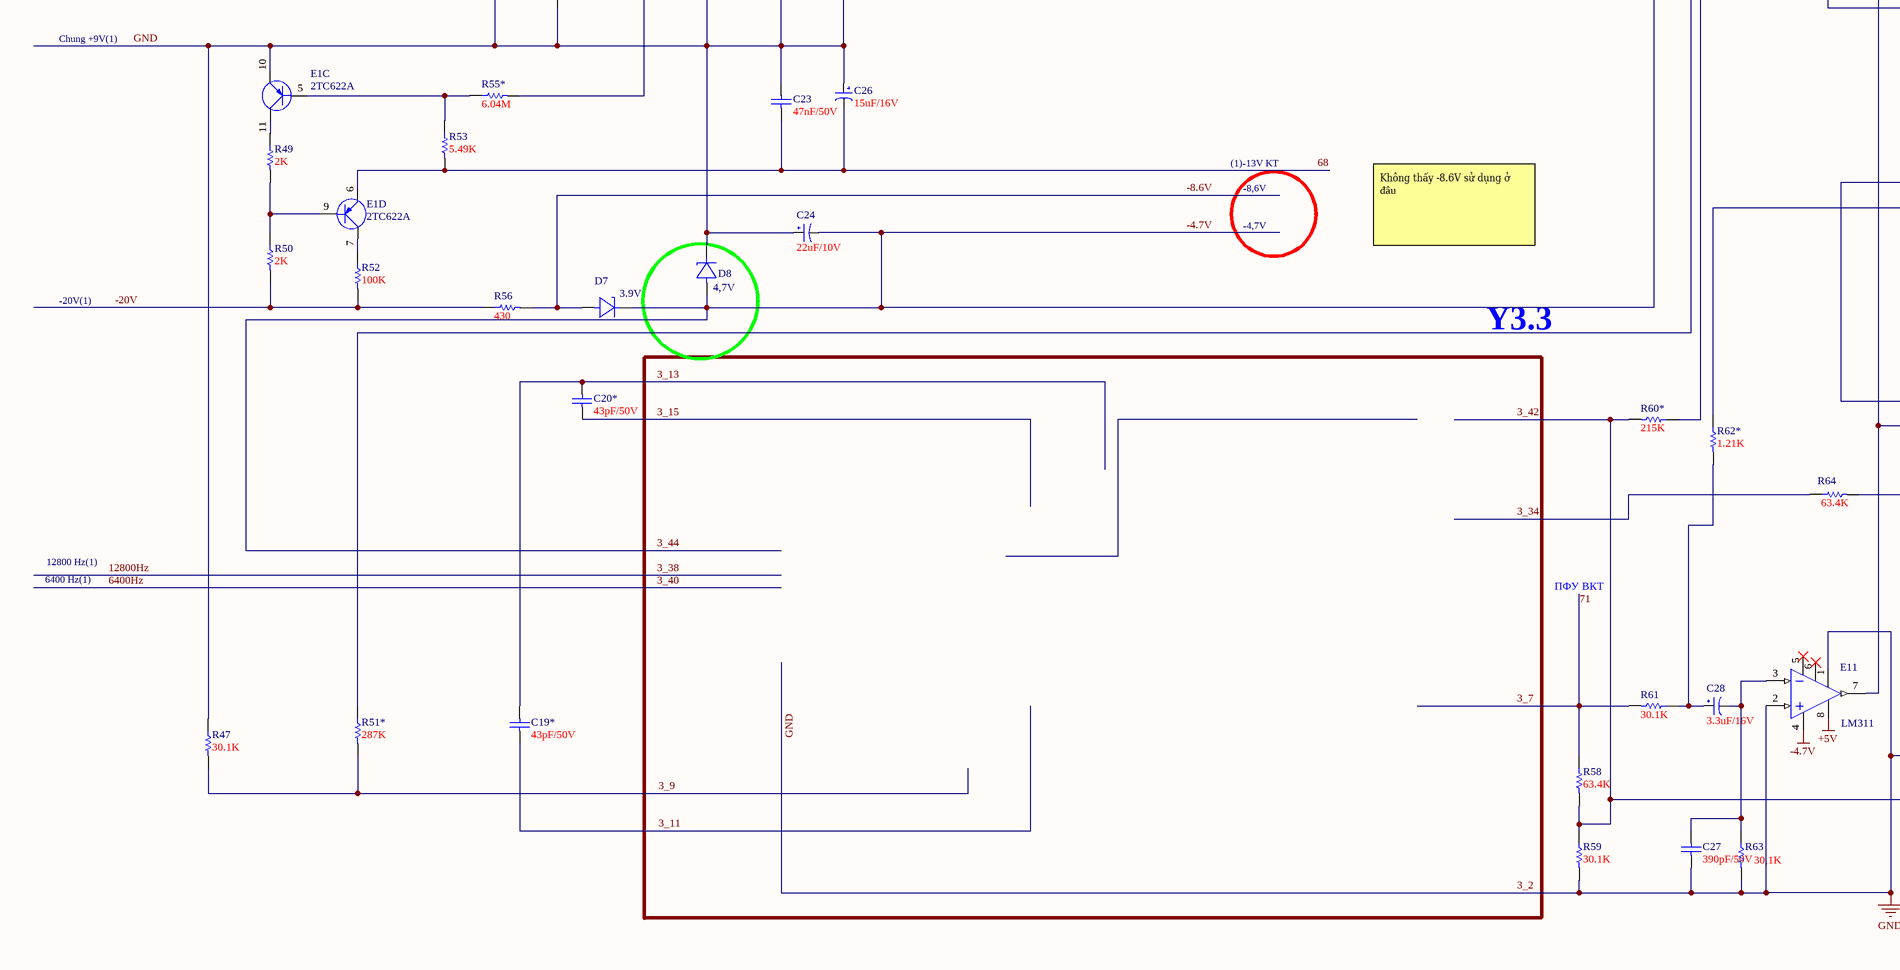
[diagram p8: MC1617.SchDoc, bottom left]
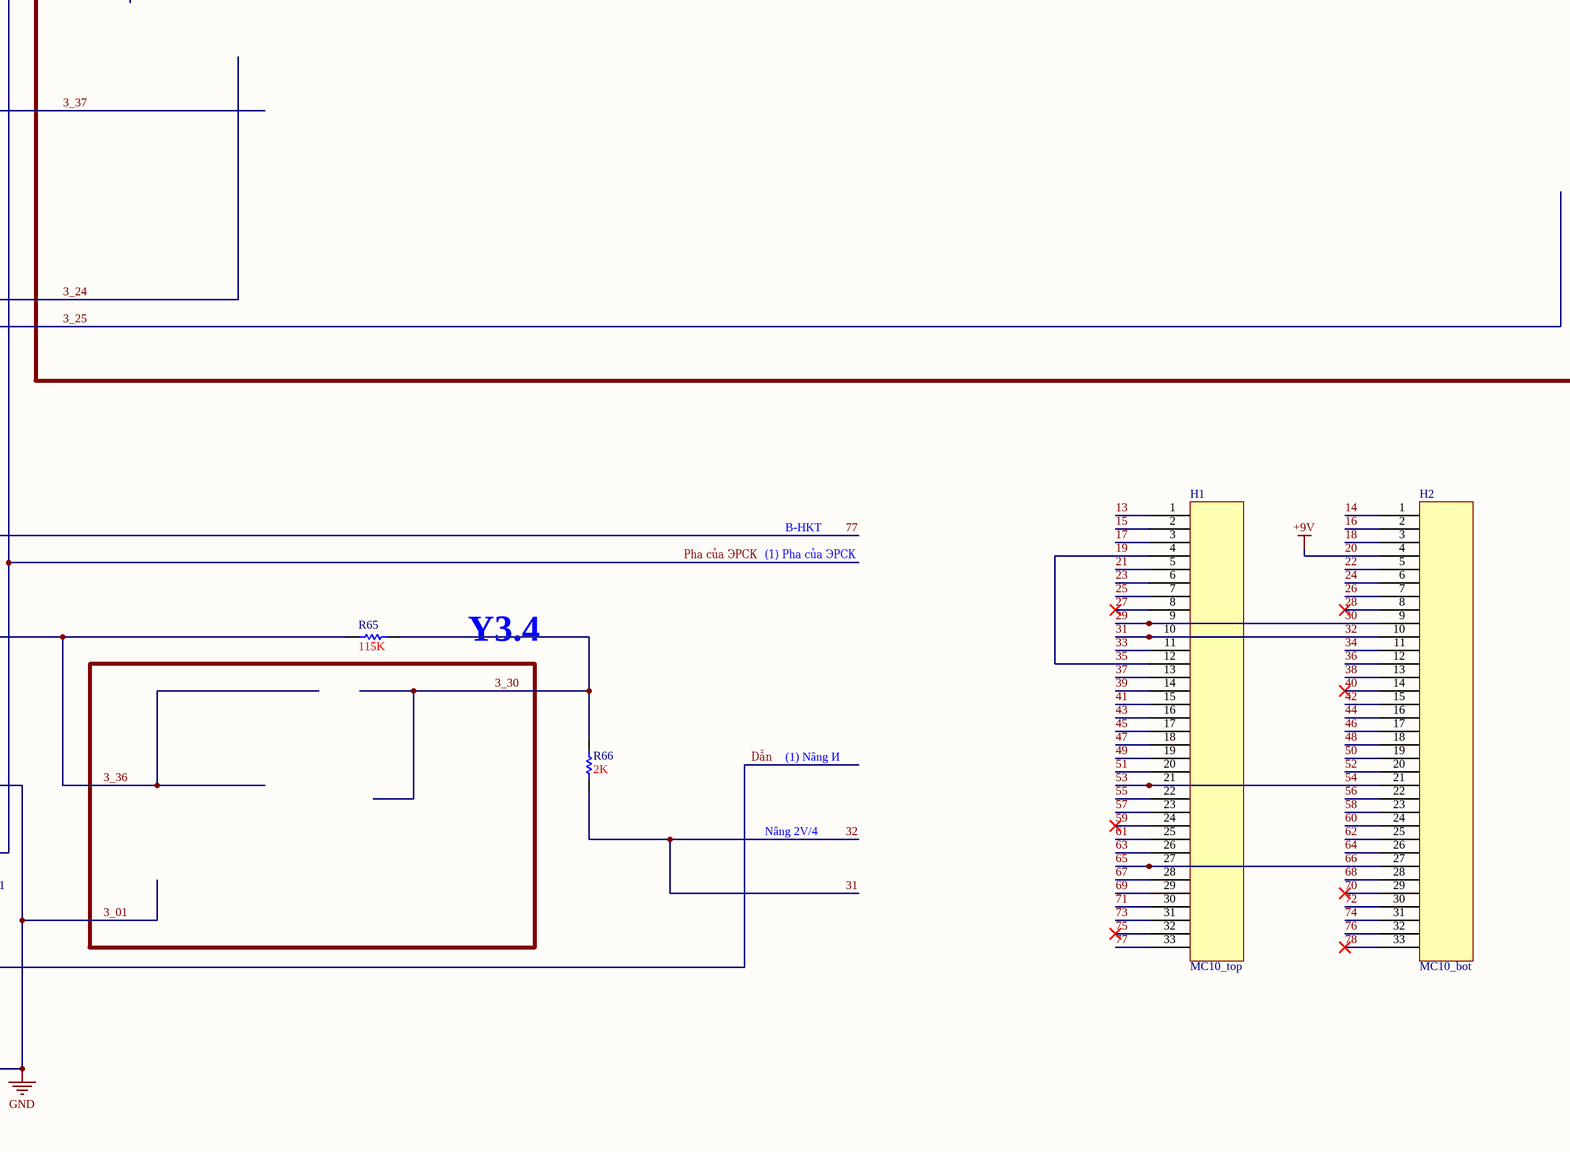
[diagram p9: MC1617.SchDoc, bottom right]

### Parts
C19*  43pF/50V  [C0805]
C20*  43pF/50V  [C0805]
C21  47nF/50V  [C0805]
C22  47nF/50V  [C0805]
C23  47nF/50V  [C0805]
C24  22uF/10V  [C1206]
C25  15uF/16V  [C3528]
C26  15uF/16V  [C3528]
C27  390pF/50V  [C0805]
C28  3.3uF/16V  [C1206]
D7  3.9V  [sod-80]
D8  4,7V  [sod-80]
E1  2ТС622А  [1533LN1]  (parts C,D of 5)
E10  142EH2A  [142EN2A]
E11  LM311  [soic8]
H1  MC10_top  [socket_33p]
H2  MC10_bot  [socket_33p]
R47  30.1K  [r0805]
R48  100R  [res1206]
R49  2K  [r0805]
R50  2K  [r0805]
R51*  287K  [r0805]
R52  100K  [r0805]
R53  5.49K  [r0805]
R54  1.62K  [r0805]
R55*  6.04M  [r0805]
R56  430  [R2512]
R57*  7.68K  [r0805]
R58  63.4K  [r0805]
R59  30.1K  [r0805]
R60*  215K  [r0805]
R61  30.1K  [r0805]
R62*  1.21K  [r0805]
R63  30,1K  [r0805]
R64  63.4K  [r0805]
R65  115K  [r0805]
R66  2K  [r0805]
R67  61.9K  [r0805]

### Nets
3_01: C22.2 C23.1 C24.1 C25.2 C26.1 C27.1 D8.2 E1.10 E10.8 E11.1(COM) E11.2(IN+) H1.29 R47.1 R54.2 R59.2 R63.2  [also labelled 3_03, 3_2, 69, GND]  [project net 1_3]
3_26: C22.1 C25.1 E10.13 H2.25 R55*.2 R57*.1 R67.2  [also labelled 62]  [project net 1_26]
19: H1.4 H1.12 H1.27 H2.4 H2.27  [also labelled +9V, 20, 35, 65, 66]
+5V: E11.8(+V) H1.23 H2.26  [also labelled 57, 64]
-4.7V: C24.2 D7.2 D8.1 E11.4(-V)  [also labelled 2_19, 3_44, Thiên áp]
2_21: R51*.1
2_23: R67.1  [also labelled CK đến Cф]
3_7: H1.30 R58.1 R61.2  [also labelled 71]
3_8: H2.30  [also labelled 72]
3_9: R47.2 R51*.2
3_11: C19*.1
3_13: C19*.2 C20*.2
3_15: C20*.1
3_22: H2.31 H2.32  [also labelled 74, 76]
3_24: H1.33  [also labelled 77]
3_25: R62*.1
3_27: E11.7(OUT)  [also labelled Pha của ЭРСК]
3_30: R65.2 R66.2
3_34: R64.1
3_36: R64.2 R65.1
3_37: H1.28  [also labelled 67]
3_41: R60*.1
3_42: R58.2 R59.1 R60*.2  [also labelled Dẫn]
13: H1.1
14: H2.1 H2.2  [also labelled 16]
15: H1.2
17: H1.3 H1.17  [also labelled 45]
18: H1.16 H2.3  [also labelled 43]
21: H1.5
22: H1.6 H2.5 H2.15  [also labelled 23, 42]  [project net 1_12]
24: H2.6 H2.7 H2.18  [also labelled 26, 48]  [project net 1_16]
25: H1.7
27: H1.8
28: H2.8
29: H1.9 H2.9  [also labelled 30]  [project net 1_22]
31: H1.10 H2.10 R66.1  [also labelled 32]
33: H1.11  [project net 1_30]
34: H2.11
36: H1.22 H2.12  [also labelled 55]  [project net 2_46]
37: H1.13 H2.23 H2.24  [also labelled 58, 60]  [project net 2_20]
39: H1.14 H1.15  [also labelled 41]  [project net 2_7]
40: H2.14
44: H1.18 H2.16 H2.17  [also labelled 46, 47]  [project net 2_11]
50: H2.19 H2.20  [also labelled 52]  [project net 2_42]
53: H1.21 H2.21  [also labelled 54]  [project net 2_32]
56: H2.22  [project net 2_18]
59: H1.24
68: C23.2 C26.2 E1.6 H2.28 R53.2  [project net -13V]
70: H2.29
75: H1.32
78: H2.33
25600Hz: H1.31 H2.13  [also labelled 38, 3_10, 73]
+20V: E10.4 H1.25 H1.26 R48.1  [also labelled 2_28, 61, 63]
-8.6V: D7.1 R56.2
-20V: H1.19 H1.20 R50.2 R52.2 R56.1  [also labelled 49, 51]
NetC21_1: C21.1 E10.2
NetC21_2: C21.2 E10.12 R54.1 R57*.2
NetC27_2: C27.2 C28.2 E11.3(IN-) R63.1
NetC28_1: C28.1 R61.1 R62*.2
NetE1_5: E1.5 R53.1 R55*.1
NetE1_7: E1.7 R52.1
NetE1_9: E1.9 R49.2 R50.1
NetE1_11: E1.11 R49.1
NetE10_16: E10.16 R48.2

Not connected (* = marked no-connect by the designer): E11 5* 6*

### Notes on the sheet
- Ngắt nâng[1]
- Y3.5
- (1) Chuyển dịch
- Đóng Ф Sin(1)
- PP giữ chậm И[1]
- В-Н
- ГОН 180
- CK đến CФ(1)
- Y2.3
- 100Hz
- 200Hz(1)
- Điều chế (1)
- 25600Hz(1)
- (1)  Pha của ЭРСЛ
- Y3.2
- tu C3_03 chi la tu loc nguon +13V voi GND
- +20V(1)
- (1) +13V kiểm tra
- Chung +9V(1)
- (1)-13V KT
- -8,6V
- -4,7V
- Không thấy -8.6V sử dụng ở đâu
- -20V(1)
- Y3.3
- (1) Pha của ЭРСК
- B-HKT
- Y3.4
- 6400 Hz(1)
- 12800 Hz(1)
- ПФУ ВКТ
- (1) Nâng И
- Nâng 2V/4
- (in symbol E10-EH2A) Вх; ВН; ОП; К; EH2A; Р; 2-03; Общ

### Library data of the parts
C19* C20* C21-C23 C27 = Cap ceramic: as C1 on sheet MC1516
  C19* C20*: Value: 43pF/50V
  C21-C23: Value: 47nF/50V
  C27: Value: 390pF/50V
C24-C26 C28 = CP2: as C5_03 on sheet MC1516
D7 D8 = 2С191Ф: Diode Zener
E1 = 2ТС622А: PNP
E10 = E10-EH2A
E11 = 521СА3: OpAmp
H2 = MC10_top
R47-R50 R51* R52-R54 R55* R56 R57* R58 R59 R60* R61 R62* R63-R67 = Res: as R1 on sheet MC1516
  R47 R59 R61: Value: 30.1K
  R48: Value: 100R
  R49 R50 R66: Value: 2K
  R51*: Value: 287K
  R52: Value: 100K
  R53: Value: 5.49K
  R54: Value: 1.62K
  R55*: Value: 6.04M
  R56: Value: 430
  R57*: Value: 7.68K
  R58 R64: Value: 63.4K
  R60*: Value: 215K
  R62*: Value: 1.21K
  R63: Value: 30,1K
  R65: Value: 115K
  R67: Value: 61.9K

## Nets that join several sheets
1_3: MC1516 (39 pins), MC1617 (16 pins)
1_26: MC1516 (H1_2.2 H1_2.23 H3_2.2), MC1617 (7 pins)
19: MC1516 (20 pins), MC1617 (5 pins)
+5V: MC1516 (8 pins), MC1617 (E11.8 H1.23 H2.26)
-4.7V: MC1516 (7 pins), MC1617 (C24.2 D7.2 D8.1 E11.4)
1_12: MC1516 (6 pins), MC1617 (H1.6 H2.5 H2.15)
1_16: MC1516 (H1_1.16 R1.1 R8.1 R16.2), MC1617 (H2.6 H2.7 H2.18)
1_22: MC1516 (H1_1.22), MC1617 (H1.9 H2.9)
1_30: MC1516 (H1_2.6 R36*.2), MC1617 (H1.11)
2_7: MC1516 (H2_1.7), MC1617 (H1.14 H1.15)
2_11: MC1516 (H2_1.11), MC1617 (H1.18 H2.16 H2.17)
2_18: MC1516 (H2_1.18), MC1617 (H2.22)
2_20: MC1516 (H2_1.20), MC1617 (H1.13 H2.23 H2.24)
2_21: MC1516 (H2_1.21), MC1617 (R51*.1)
2_23: MC1516 (H2_1.23 R22.2), MC1617 (R67.1)
2_32: MC1516 (H2_2.8), MC1617 (H1.21 H2.21)
2_42: MC1516 (H2_2.18), MC1617 (H2.19 H2.20)
2_46: MC1516 (H2_2.22 R42*.2), MC1617 (H1.22 H2.12)
3_7: MC1516 (H3_1.7), MC1617 (H1.30 R58.1 R61.2)
3_8: MC1516 (H3_1.8), MC1617 (H2.30)
3_9: MC1516 (H3_1.9), MC1617 (R47.2 R51*.2)
3_11: MC1516 (H3_1.11), MC1617 (C19*.1)
3_13: MC1516 (H3_1.13), MC1617 (C19*.2 C20*.2)
3_15: MC1516 (H3_1.15), MC1617 (C20*.1)
3_22: MC1516 (H3_1.22), MC1617 (H2.31 H2.32)
3_24: MC1516 (H3_1.24), MC1617 (H1.33)
3_25: MC1516 (H3_2.1), MC1617 (R62*.1)
3_27: MC1516 (E6.1 E7.6 H3_2.3), MC1617 (E11.7)
3_30: MC1516 (H3_2.6), MC1617 (R65.2 R66.2)
3_34: MC1516 (H3_2.10), MC1617 (R64.1)
3_36: MC1516 (H3_2.12), MC1617 (R64.2 R65.1)
3_37: MC1516 (H3_2.13), MC1617 (H1.28)
3_41: MC1516 (H3_2.17), MC1617 (R60*.1)
3_42: MC1516 (H3_2.18 R37*.2), MC1617 (R58.2 R59.1 R60*.2)
13: MC1516 (P1.11), MC1617 (H1.1)
14: MC1516 (P1.23), MC1617 (H2.1 H2.2)
15: MC1516 (P1.21), MC1617 (H1.2)
17: MC1516 (E4.12), MC1617 (H1.3 H1.17)
18: MC1516 (E4.4), MC1617 (H1.16 H2.3)
21: MC1516 (C5_03.2 H3_1.23 R45.1), MC1617 (H1.5)
25: MC1516 (R15.2), MC1617 (H1.7)
34: MC1516 (R43.2), MC1617 (H2.11)
25600Hz: MC1516 (H2_2.1 H3_1.10), MC1617 (H1.31 H2.13)
+20V: MC1516 (E3.4 H2_2.4 R4.2), MC1617 (E10.4 H1.25 H1.26 R48.1)
-8.6V: MC1516 (H1_1.1 H3_1.5), MC1617 (D7.1 R56.2)
-13V: MC1516 (H1_1.2 H1_1.23 H3_1.19 R44.1), MC1617 (5 pins)
-20V: MC1516 (D1.1 H2_1.6 P1.B), MC1617 (5 pins)